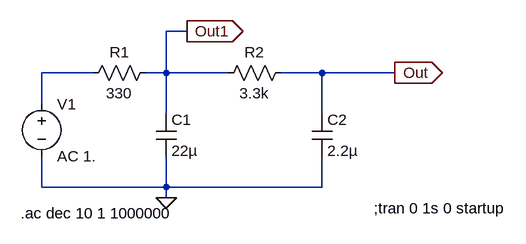
[diagram p0: schematic rc-filter.asc]
rc-filter.asc, the LTspice schematic file:
Version 4
SHEET 1 880 680
WIRE 224 -32 192 -32
WIRE 80 32 0 32
WIRE 192 32 192 -32
WIRE 192 32 160 32
WIRE 288 32 192 32
WIRE 432 32 368 32
WIRE 544 32 432 32
WIRE 0 80 0 32
WIRE 192 96 192 32
WIRE 432 96 432 32
WIRE 0 208 0 160
WIRE 192 208 192 160
WIRE 192 208 0 208
WIRE 432 208 432 160
WIRE 432 208 192 208
WIRE 192 224 192 208
FLAG 192 224 0
FLAG 544 32 Out
IOPIN 544 32 Out
FLAG 224 -32 Out1
IOPIN 224 -32 Out
SYMBOL res 176 16 R90
WINDOW 0 0 56 VBottom 2
WINDOW 3 32 56 VTop 2
SYMATTR InstName R1
SYMATTR Value 330
SYMATTR SpiceLine tol=5 pwr=0.25
SYMBOL cap 176 96 R0
SYMATTR InstName C1
SYMATTR Value 22µ
SYMBOL voltage 0 64 R0
SYMATTR InstName V1
SYMATTR Value AC 1.
SYMBOL res 384 16 R90
WINDOW 0 0 56 VBottom 2
WINDOW 3 32 56 VTop 2
SYMATTR InstName R2
SYMATTR Value 3.3k
SYMATTR SpiceLine tol=5 pwr=0.25
SYMBOL cap 416 96 R0
SYMATTR InstName C2
SYMATTR Value 2.2µ
TEXT -32 248 Left 2 !.ac dec 10 1 1000000
TEXT 512 240 Left 2 !;tran 0 1s 0 startup

The netlist it stands for:
* rc-filter.asc
R1 Out1 N001 330 tol=5 pwr=0.25
C1 Out1 0 22µ
V1 N001 0 AC 1.
R2 Out Out1 3.3k tol=5 pwr=0.25
C2 Out 0 2.2µ
.ac dec 10 1 1000000
;tran 0 1s 0 startup
.backanno
.end

* Results of the author's LTspice run, read from the files saved beside the schematic
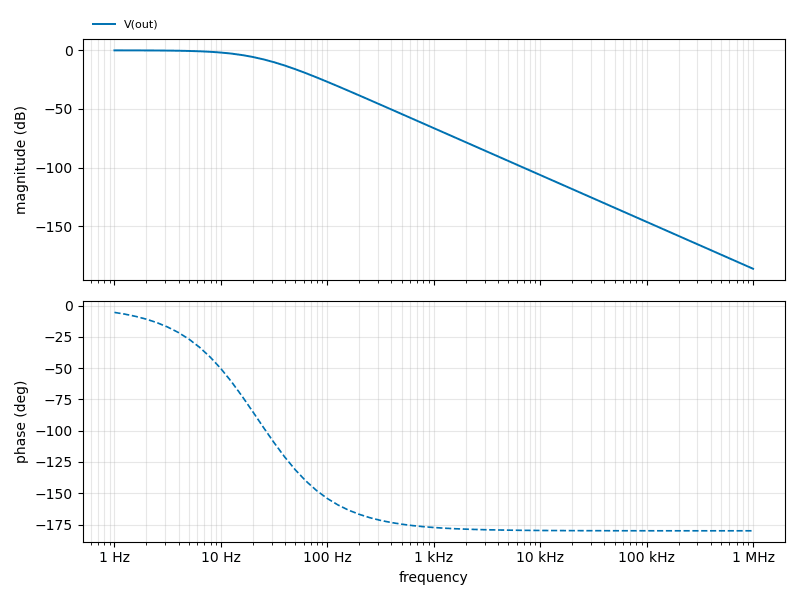
[diagram p1: AC Analysis of rc-filter.asc, plotted from the saved traces]
* AC Analysis, 1 run:
*   V(out): -0.02 dB at 1 Hz, -186.36 dB at 1 MHz, peak -0.02 dB at 1 Hz, 3 dB below the peak at 13.15 Hz